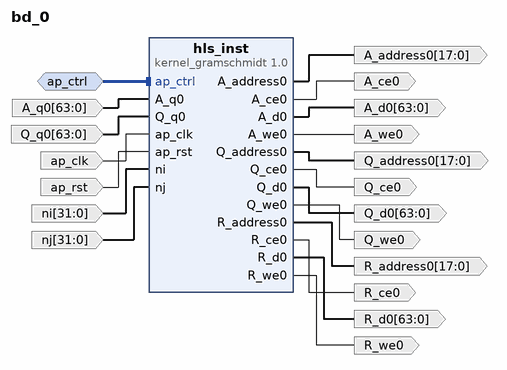
[diagram p0: block diagram of the top level]
# Vivado block design bd_0, xcu50-fsvh2104-2-e, Vivado 2023.2
create_bd_design bd_0

create_bd_intf_port -mode Slave -vlnv xilinx.com:interface:acc_handshake_rtl:1.0 ap_ctrl
create_bd_port -dir O -from 17 -to 0 -type data A_address0
create_bd_port -dir O A_ce0
create_bd_port -dir O -from 63 -to 0 -type data A_d0
create_bd_port -dir I -from 63 -to 0 -type data A_q0
create_bd_port -dir O A_we0
create_bd_port -dir O -from 17 -to 0 -type data Q_address0
create_bd_port -dir O Q_ce0
create_bd_port -dir O -from 63 -to 0 -type data Q_d0
create_bd_port -dir I -from 63 -to 0 -type data Q_q0
create_bd_port -dir O Q_we0
create_bd_port -dir O -from 17 -to 0 -type data R_address0
create_bd_port -dir O R_ce0
create_bd_port -dir O -from 63 -to 0 -type data R_d0
create_bd_port -dir O R_we0
create_bd_port -dir I -type clk ap_clk
set_property -dict {CONFIG.FREQ_HZ 125000000.0} [get_bd_ports ap_clk]
create_bd_port -dir I -type rst ap_rst
set_property -dict {CONFIG.POLARITY ACTIVE_HIGH} [get_bd_ports ap_rst]
create_bd_port -dir I -from 31 -to 0 -type data ni
create_bd_port -dir I -from 31 -to 0 -type data nj

create_bd_cell -type ip -vlnv xilinx.com:hls:kernel_gramschmidt:1.0 hls_inst

# ---- connections ----

connect_bd_intf_net -intf_net ap_ctrl_0_1 [get_bd_intf_ports ap_ctrl] [get_bd_intf_pins hls_inst/ap_ctrl]
connect_bd_net -net A_q0_0_1 [get_bd_ports A_q0] [get_bd_pins hls_inst/A_q0]
connect_bd_net -net Q_q0_0_1 [get_bd_ports Q_q0] [get_bd_pins hls_inst/Q_q0]
connect_bd_net -net ap_clk_0_1 [get_bd_ports ap_clk] [get_bd_pins hls_inst/ap_clk]
connect_bd_net -net ap_rst_0_1 [get_bd_ports ap_rst] [get_bd_pins hls_inst/ap_rst]
connect_bd_net [get_bd_pins hls_inst/A_address0] [get_bd_ports A_address0]
connect_bd_net [get_bd_pins hls_inst/A_ce0] [get_bd_ports A_ce0]
connect_bd_net [get_bd_pins hls_inst/A_d0] [get_bd_ports A_d0]
connect_bd_net [get_bd_pins hls_inst/A_we0] [get_bd_ports A_we0]
connect_bd_net [get_bd_pins hls_inst/Q_address0] [get_bd_ports Q_address0]
connect_bd_net [get_bd_pins hls_inst/Q_ce0] [get_bd_ports Q_ce0]
connect_bd_net [get_bd_pins hls_inst/Q_d0] [get_bd_ports Q_d0]
connect_bd_net [get_bd_pins hls_inst/Q_we0] [get_bd_ports Q_we0]
connect_bd_net [get_bd_pins hls_inst/R_address0] [get_bd_ports R_address0]
connect_bd_net [get_bd_pins hls_inst/R_ce0] [get_bd_ports R_ce0]
connect_bd_net [get_bd_pins hls_inst/R_d0] [get_bd_ports R_d0]
connect_bd_net [get_bd_pins hls_inst/R_we0] [get_bd_ports R_we0]
connect_bd_net -net ni_0_1 [get_bd_ports ni] [get_bd_pins hls_inst/ni]
connect_bd_net -net nj_0_1 [get_bd_ports nj] [get_bd_pins hls_inst/nj]

validate_bd_design
save_bd_design
